# Altium schematic sheet Sheet1.SchDoc
size A; SheetNumber: 1; SheetTotal: 1
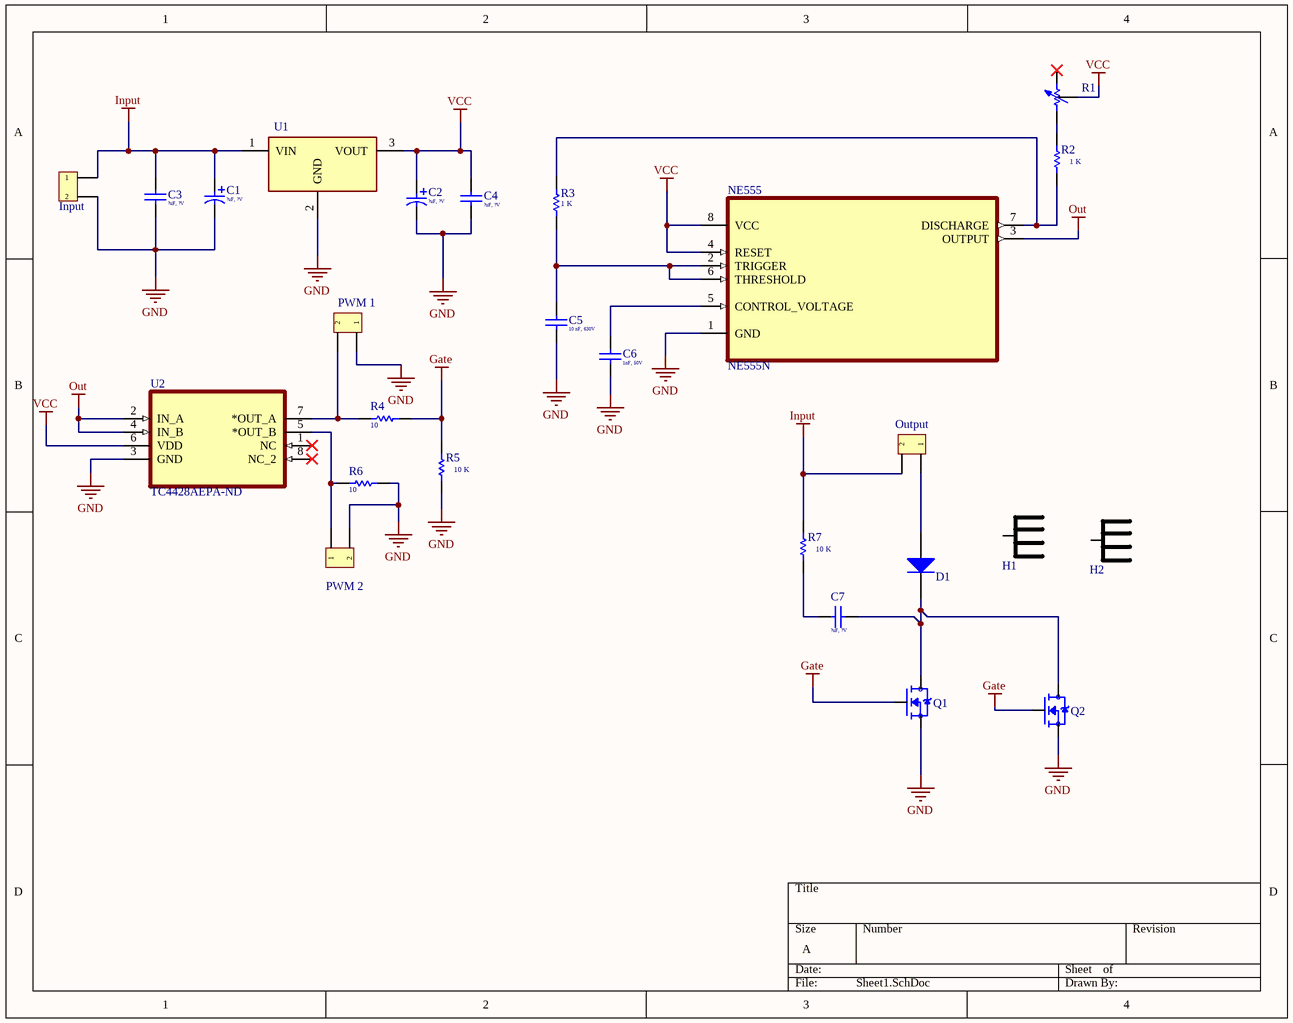
[diagram p0: Sheet1.SchDoc]

## Parts
C1  value ?uF, ?V  [Capacitor Aluminum Electrolytic DIP 10*13*5]  (hidden comment: (DIGIKEY Part Number))
C2  value ?uF, ?V  [Capacitor Aluminum Electrolytic DIP 10*13*5]  (hidden comment: (DIGIKEY Part Number))
C3  value ?uF, ?V  [Capacitor Film DIP 01]  (hidden comment: (DIGIKEY Part Number))
C4  value ?uF, ?V  [Capacitor Film DIP 01]  (hidden comment: (DIGIKEY Part Number))
C5  value 10 nF, 630V  [Capacitor Film DIP 01]  (hidden comment: (DIGIKEY Part Number))
C6  value 1nF, 50V  [Capacitor Film DIP 01]  (hidden comment: (DIGIKEY Part Number))
C7  value ?uF, ?V  [Capacitor Ceramic Lens DIP]  (hidden comment: (DIGIKEY Part Number))
D1  (DIGIKEY Part Number)  [Diode DIP DO-41 01]  (value not drawn)
H1  (DIGIKEY Part Number)  [HEATSINK 02]  (value not drawn)
H2  (DIGIKEY Part Number)  [HEATSINK 05]  (value not drawn)
Input  (DIGIKEY Part Number)  [Phoenix Contact 2x2 Male Straight]  (value not drawn)
NE555  NE555N  [NE555 DIP-8]
Output  (DIGIKEY Part Number)  [Phoenix Contact 2x2 Male Straight]  (value not drawn)
PWM_1  (DIGIKEY Part Number)  [Header 01 1x2]  (value not drawn)
PWM_2  (DIGIKEY Part Number)  [Header 01 1x2]  (value not drawn)
Q1  (DIGIKEY Part Number)  [MOSFET DIP TO-220]  (value not drawn)
Q2  (DIGIKEY Part Number)  [MOSFET DIP TO-220]  (value not drawn)
R1  (DIGIKEY Part Number)  [Resistor Variable DIP 03]  (value not drawn)
R2  value 1 K  [Resistor DIP 0.25W 01]  (hidden comment: (DIGIKEY Part Number))
R3  value 1 K  [Resistor DIP 0.25W 01]  (hidden comment: (DIGIKEY Part Number))
R4  value 10  [Resistor DIP 0.25W 01]  (hidden comment: (DIGIKEY Part Number))
R5  value 10 K  [Resistor DIP 0.25W 01]  (hidden comment: (DIGIKEY Part Number))
R6  value 10  [Resistor DIP 0.25W 01]  (hidden comment: (DIGIKEY Part Number))
R7  value 10 K  [Resistor DIP 0.25W 01]  (hidden comment: (DIGIKEY Part Number))
U1  (DIGIKEY Part Number)  [Linear Regulator DIP TO-220-3]  (value not drawn)
U2  TC4428AEPA-ND  [Gate Driver TC4428AEPA DIP 01]

## Nets
Gate: Q1.1(G) Q2.1(G) R4.2 R5.1
GND: C1.2 C2.2 C3.1 C4.1 C5.1 C6.1 Input.2 NE555.1(GND) PWM_1.1 PWM_2.2 Q1.3(S) Q2.3(S) R5.2 R6.2 U1.2(GND) U2.3(GND)
Input: C1.1 C3.2 Input.1 Output.2 R7.1 U1.1(VIN)
Out: NE555.3(OUTPUT) U2.2(IN_A) U2.4(IN_B)
VCC: C2.1 C4.2 NE555.4(RESET) NE555.8(VCC) R1.2 U1.3(VOUT) U2.6(VDD)
NetC5_2: C5.2 NE555.2(TRIGGER) NE555.6(THRESHOLD) R3.1
NetC6_2: C6.2 NE555.5(CONTROL_VOLTAGE)
NetC7_1: C7.1 R7.2
NetC7_2: C7.2 D1.2(K) Q1.2(D) Q2.2(D)
NetD1_1: D1.1(A) Output.1
NetNE555_7: NE555.7(DISCHARGE) R2.2 R3.2
NetPWM_1_2: PWM_1.2 R4.1 U2.7(*OUT_A)
NetPWM_2_1: PWM_2.1 R6.1 U2.5(*OUT_B)
NetR1_1: R1.1 R2.1

Not connected (* = marked no-connect by the designer): R1 3*; U2 1(NC)* 8(NC_2)*

## Library data of the parts
C1 C2 = Capacitors Electrolytic: Aluminum Electrolytic Capacitors; MF: Nichicon; MP: UVR2A471MHD; Price: None; Package: Radial Nichicon; SnapEDA_Link: https://www.snapeda.com/parts/UVR2A471MHD/Nichicon/view-part/2302933/?ref=snap; Availability: Unavailable; Supplier 1: Digi-Key; Supplier Part Number 1: 1189-2012-ND
C3-C7 = Capacitors Non-Electrolytic: Ceramic & Polyester Capacitor
D1 = Diode: Through Hole & SMD Diode; Published: 8-Jun-2000; LatestRevisionDate: 17-Jul-2002; LatestRevisionNote: Re-released for DXP Platform.; DatasheetVersion: Aug-1984; PackageReference: DO-201AD; Publisher: Altium Limited; PackageDescription: Diode, Axial; Body 9.5 x 5.3 mm (LxDia. max), Lead Dia. 1.32 mm (max); ComponentLink1Description: Manufacturer Link; ComponentLink1URL: http://www.irf.com/
H1 H2 = Heat Sink: Heat Sink TO-220 Aluminum 20.0W @ 60Â°C Board Level, Vertical; MP: 530002B02500G; MF: Aavid Thermalloy; Value: *; SnapEDA_Link: https://www.snapeda.com/parts/530002B02500G/Aavid+Thermalloy/view-part/?ref=snap; Purchase-URL: https://pricing.snapeda.com/search/part/530002B02500G/?ref=eda; Check_prices: https://www.snapeda.com/parts/530002B02500G/Aavid+Thermalloy/view-part/?ref=eda; Availability: In Stock; Price: None; Package: None
Input Output PWM_1 PWM_2 = Contact-Phoenix 2x: Manufacturer: Phoenix Contact; Manufacturer Part Number: 1715721; Max Current Rating: 22A; Number of Poles: 2; Voltage Rating: 400V; Max Supply Voltage: 250V; Current Rating: 17.5A; Number of Levels: 1; Current: 15A; Voltage: 300V; Connector Type: Screw,Terminal Block,PCB; Test Voltage: 4kV; Wire Gauge (Max): 26AWG; Wire/Cable Gauge: 14AWG; Pitch: 5.08mm; Stripping Length: 7mm; Approvals: UL,CSA,cULus,EAC; Supplier 1: Digi-Key; RoHS: Yes; Category: Terminal Blocks; Stock 1: 4962; Pricing 1: 1=1.39000, 10=1.33400, 50=1.27600, 100=1.24120, 250=1.16000, 500=1.06720, 1000=0.98600, 2500=0.93960, 5000=0.89320 (USD); Mount: Through Hole; Number of Pins: 2; Color: Green; Weight: 0.103705oz; Housing Color: Green; Housing Material: Polyamide; Insulation Material: Nylon; Contact Material: Tin; Min Operating Temperature: -20°C; Max Operating Temperature: 100°C; Number of Rows: 1; Package Quantity: 50; Voltage Rating (AC): 250V; Packaging: Bulk; Number of Positions: 2; Termination: Screw; Number of Positions Per Level: 2; Number of Contacts: 2; Number of Circuits: 2; Orientation: Straight; Series: MKDS; Length: 10.16mm; Width: 17.3mm; Height: 17.3mm; Wire Gauge (Min): 26AWG; Depth: 9.8mm; Radiation Hardening: No; REACH SVHC: No SVHC; Lead Free: Lead Free; Flammability Rating: UL94 V-0; RoHS Compliant: Yes; ComponentLink1URL: https://datasheet.ciiva.com/16046/1715721-16046034.pdf?src-supplier=Onlinecomponents.com; ComponentLink1Description: https://datasheet.ciiva.com/16046/1715721-16046034.pdf?src-supplier=Onlinecomponents.com; ComponentLink2URL: https://datasheet.ciiva.com/1120/1697161-1120393.pdf?src-supplier=Farnell; ComponentLink2Description: https://datasheet.ciiva.com/1120/1697161-1120393.pdf?src-supplier=Farnell; ComponentLink3URL: https://datasheet.ciiva.com/15169/getdatasheetpartid-212174-15169929.pdf?src-supplier=Verical; ComponentLink3Description: https://datasheet.ciiva.com/15169/getdatasheetpartid-212174-15169929.pdf?src-supplier=Verical; ComponentLink4URL: https://datasheet.ciiva.com/832/1715721-832095.pdf?src-supplier=Digi-Key; ComponentLink4Description: https://datasheet.ciiva.com/832/1715721-832095.pdf?src-supplier=Digi-Key; Supplier Part Number 1: 277-1263-ND
NE555 = NE555N: 555 Type, Timer/Oscillator (Single) IC 500kHz 8-DIP; MF: STMicroelectronics; SnapEDA_Link: https://www.snapeda.com/parts/NE555N/STMicroelectronics/view-part/?ref=snap; MP: NE555N; Availability: In Stock; Price: None; Value: *; Check_prices: https://www.snapeda.com/parts/NE555N/STMicroelectronics/view-part/?ref=eda; Package: DIP-8 STMicroelectronics; Purchase-URL: https://pricing.snapeda.com/search/part/NE555N/?ref=eda
Q1 Q2 = Transistor MOSFET: N-Channel MOSFET; MP: FDN360P; MF: ON Semiconductor; Check_prices: https://www.snapeda.com/parts/FDN360P/ON%20Semiconductor/view-part/2105995/?ref=eda; Price: None; Purchase-URL: https://pricing.snapeda.com/search/part/FDN360P/?ref=eda; Availability: Good; Package: SC-59 ON Semiconductor; SnapEDA_Link: https://www.snapeda.com/parts/FDN360P/ON%20Semiconductor/view-part/2105995/?ref=snap; Value: *
R1 = Resistor Variable: Trimmer Potentiometer Cermet Top Adjustment; Set Position: 0.5; Value: 20K; Published: 8-Jun-2000; LatestRevisionDate: 17-Jul-2002; LatestRevisionNote: Re-released for DXP Platform.; PackageReference: AXIAL-0.7; Publisher: Altium Limited; PackageDescription: Axial Device, Thru-Hole; 2 Leads; 0.7 in Pin Spacing; Supplier 1: Digi-Key; Supplier Part Number 1: 3252W-103LF-ND
R2-R7 = Resistor: Through Hole & SMD; Published: 8-Jun-2000; LatestRevisionDate: 17-Jul-2002; LatestRevisionNote: Re-released for DXP Platform.; PackageReference: AXIAL-0.3; Publisher: Altium Limited; PackageDescription: Axial Device, Thru-Hole; 2 Leads; 0.3 in Pin Spacing
U1 = Linear Regulator: Voltage Regulators - Linear, Low Drop Out (LDO) Regulators; Manufacturer: STMicroelectronics; Manufacturer Part Number: LD1117DT33; Dropout Voltage: 1.1V; Max Input Voltage: 15V; Output Current: 950mA; Number of Outputs: 1; Max Power Dissipation: 12W; Output Voltage: 3.3V; Min Input Voltage: 5.3V; Max Output Current: 800mA; Min Supply Voltage: 4.75V; Input Bias Current: 5mA; Polarity: Positive; Quiescent Current: 10mA; Output Voltage Accuracy: 1%; Output Type: Fixed; Supplier 1: Mouser; RoHS: Yes; Category: Voltage Regulators - Linear; Mount: Surface Mount; Case/Package: TO-252; Number of Pins: 3; Min Operating Temperature: 0°C; Max Operating Temperature: 125°C; Package Quantity: 75; Packaging: Rail/Tube; Max Supply Voltage: 15V; Nominal Output Voltage: 3.3V; Number of Regulators: 1; Power Dissipation: 12W; Max Output Voltage: 3.3V; Termination: SMD/SMT; Voltage: 3.3V; REACH SVHC: No SVHC; RoHS Compliant: Yes; ComponentLink1URL: https://datasheet.ciiva.com/2070/cd00000544-2070990.pdf?src-supplier=Digi-Key; ComponentLink1Description: https://datasheet.ciiva.com/2070/cd00000544-2070990.pdf?src-supplier=Digi-Key; Supplier Part Number 1: 511-LD1117DT33
U2 = Gate Driver TC4428CPA: Low-Side Gate Driver IC Inverting, Non-Inverting 8-PDIP; MF: Microchip; Digi-Key_Part_Number: TC4428CPA-ND; Package: DIP-8 Microchip; SnapEDA_Link: https://www.snapeda.com/parts/TC4428CPA/Microchip/view-part/442163/?ref=snap; Value: *; MP: TC4428CPA